# EAGLE schematic BPW5031 Arcade MegaWing (EAGLE 6.3)
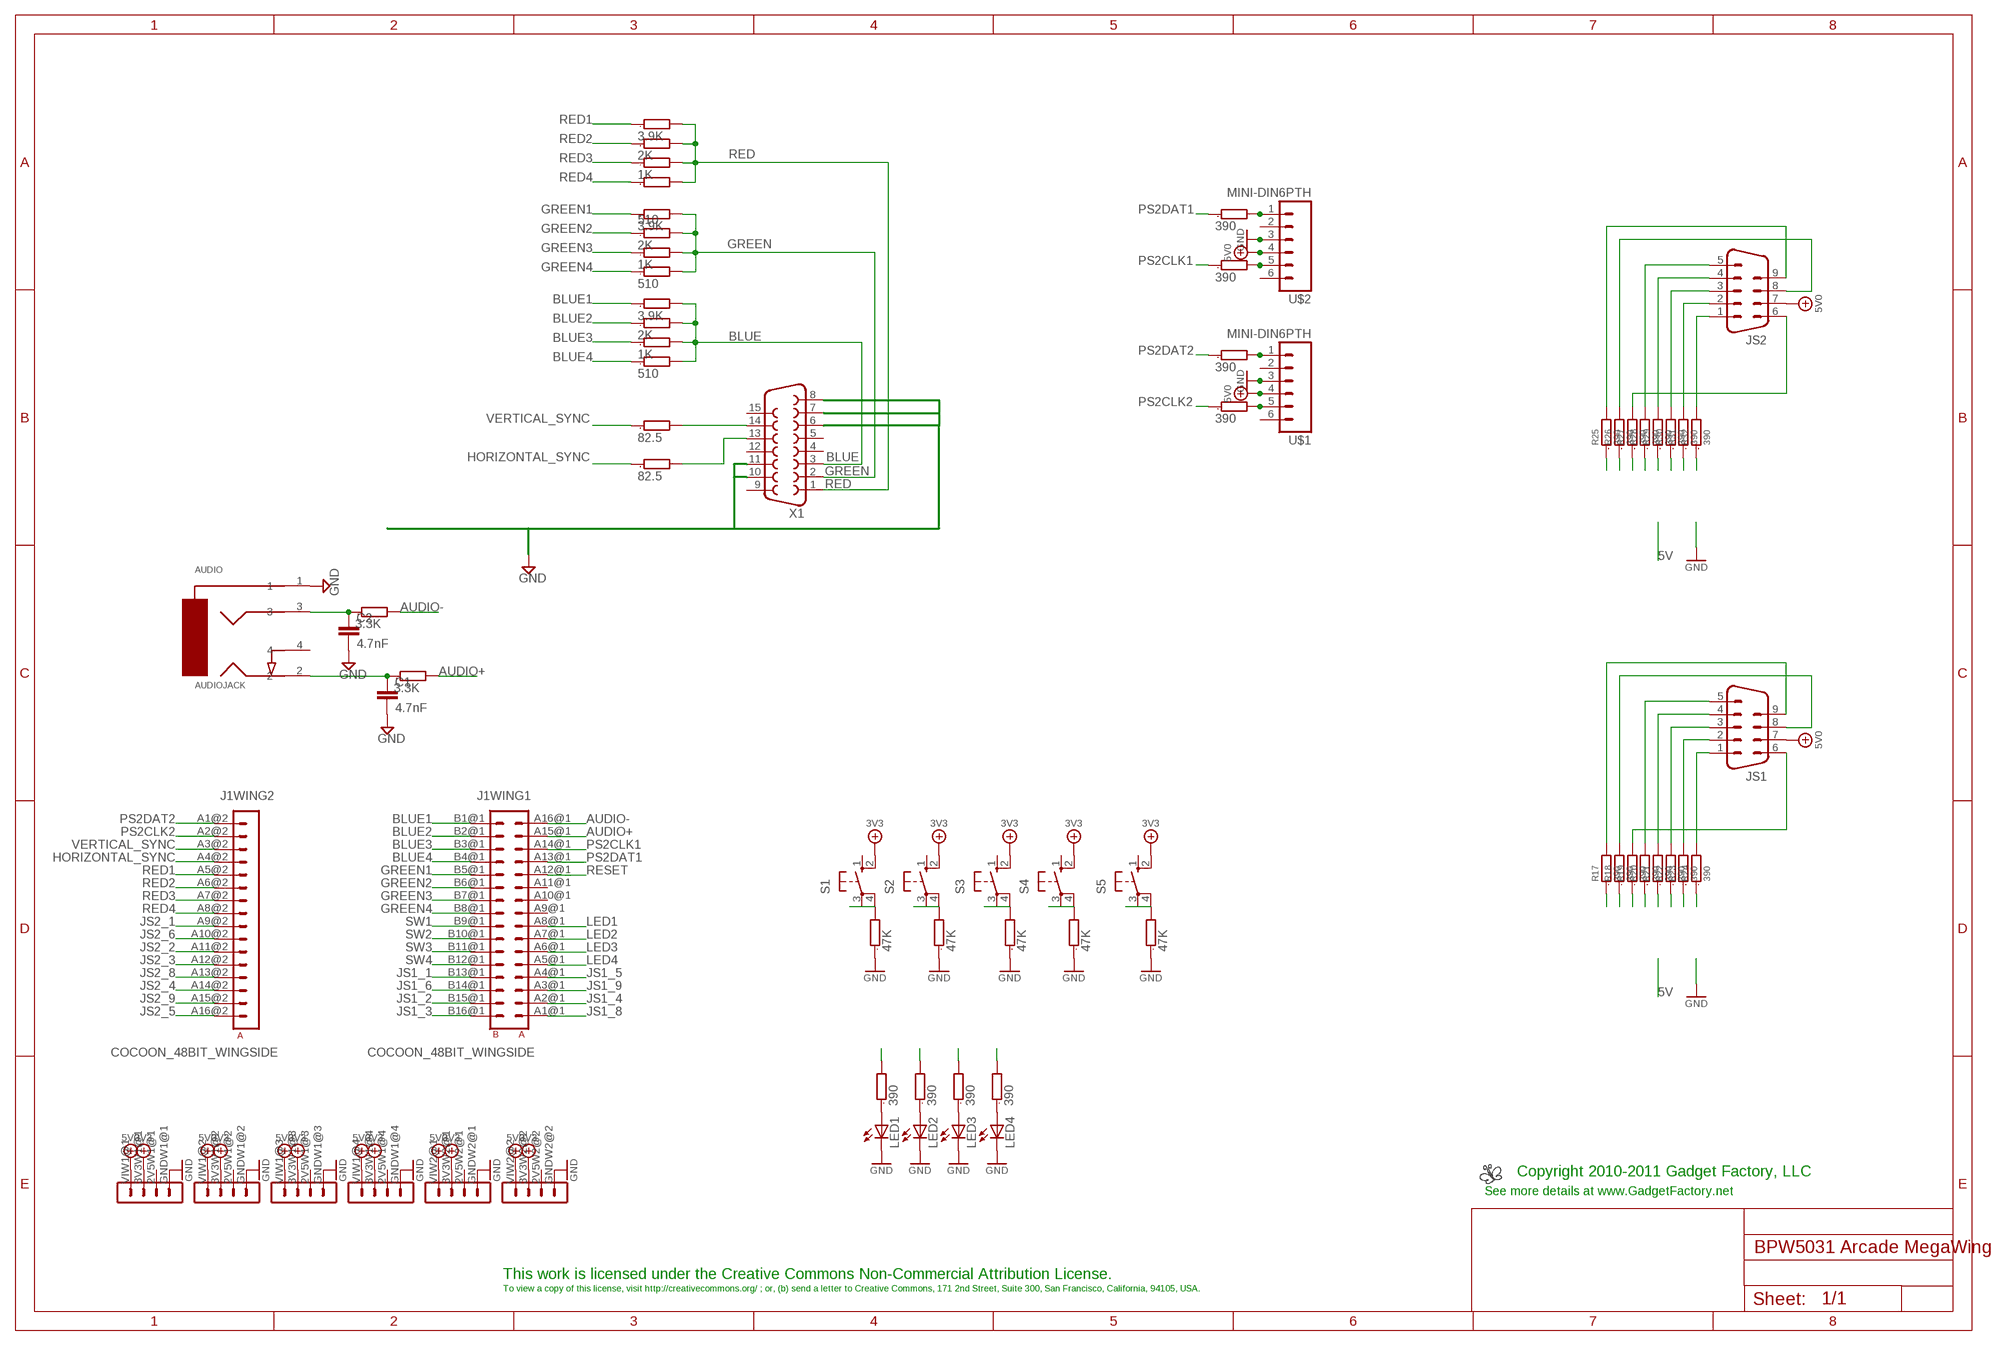
[diagram p0: schematic, sheet 1]

## Parts
AUDIO  AUDIOJACK  [AUDJCK]
C1  4.7nF  C-EU050-025X075  [C050-025X075]
C2  4.7nF  C-EU050-025X075  [C050-025X075]
J1  COCOON_48BIT_WINGSIDE  [COCOON_48BIT_WINGSIDE]
JS1  M09HP  [M09HP]
JS2  M09HP  [M09HP]
LED1  LEDCHIPLED_0603  [CHIPLED_0603]
LED2  LEDCHIPLED_0603  [CHIPLED_0603]
LED3  LEDCHIPLED_0603  [CHIPLED_0603]
LED4  LEDCHIPLED_0603  [CHIPLED_0603]
LOGO2  BUTTERFLY_LOGO  [BUTTERFLY_LOGO]
R1  3.9K  R0603  [0603]
R2  3.9K  R0603  [0603]
R3  3.9K  R0603  [0603]
R4  82.5  R0603  [0603]
R5  82.5  R0603  [0603]
R6  2K  R0603  [0603]
R7  2K  R0603  [0603]
R8  2K  R0603  [0603]
R9  1K  R0603  [0603]
R10  510  R0603  [0603]
R11  1K  R0603  [0603]
R12  510  R0603  [0603]
R13  1K  R0603  [0603]
R14  510  R0603  [0603]
R15  3.3K  R0603  [0603]
R16  3.3K  R0603  [0603]
R17  390  R0603  [0603]
R18  390  R0603  [0603]
R19  390  R0603  [0603]
R20  390  R0603  [0603]
R21  390  R0603  [0603]
R22  390  R0603  [0603]
R23  390  R0603  [0603]
R24  390  R0603  [0603]
R25  390  R0603  [0603]
R26  390  R0603  [0603]
R27  390  R0603  [0603]
R28  390  R0603  [0603]
R29  390  R0603  [0603]
R30  390  R0603  [0603]
R31  390  R0603  [0603]
R32  390  R0603  [0603]
R33  47K  R0603  [0603]
R34  47K  R0603  [0603]
R35  47K  R0603  [0603]
R36  47K  R0603  [0603]
R37  390  R0603  [0603]
R38  390  R0603  [0603]
R39  390  R0603  [0603]
R40  390  R0603  [0603]
R41  47K  R0603  [0603]
R42  390  R0603  [0603]
R43  390  R0603  [0603]
R44  390  R0603  [0603]
R45  390  R0603  [0603]
S1  10-XX  [B3F-10XX]
S2  10-XX  [B3F-10XX]
S3  10-XX  [B3F-10XX]
S4  10-XX  [B3F-10XX]
S5  10-XX  [B3F-10XX]
U$1  MINI-DIN6PTH  [MINI-DIN6]
U$2  MINI-DIN6PTH  [MINI-DIN6]
X1  F15HDH  [HDF15H]

## Nets
3V3: J1.3V3W1@1(3V3) J1.3V3W1@2(3V3) J1.3V3W1@3(3V3) J1.3V3W1@4(3V3) J1.3V3W2@1(3V3) J1.3V3W2@2(3V3) S1.2(S1) S2.2(S1) S3.2(S1) S4.2(S1) S5.2(S1)
5V0: J1.VIW1@1(5V) J1.VIW1@2(5V) J1.VIW1@3(5V) J1.VIW1@4(5V) J1.VIW2@1(5V) J1.VIW2@2(5V) JS1.7 JS2.7 U$1.4 U$2.4
AUDIO+: J1.A15@1(WING1:A15) R16.2
AUDIO-: J1.A16@1(WING1:A16) R15.2
BLUE: R3.2 R8.2 R13.2 R14.2 X1.3
BLUE1: J1.B1@1(WING1:B1) R3.1
BLUE2: J1.B2@1(WING1:B2) R8.1
BLUE3: J1.B3@1(WING1:B3) R13.1
BLUE4: J1.B4@1(WING1:B4) R14.1
GND: AUDIO.1 C1.2 C2.2 J1.GNDW1@1(GND) J1.GNDW1@2(GND) J1.GNDW1@3(GND) J1.GNDW1@4(GND) J1.GNDW2@1(GND) J1.GNDW2@2(GND) LED1.C LED2.C LED3.C LED4.C R33.1 R34.1 R35.1 R36.1 R41.1 U$1.3 U$2.3 X1.6 X1.7 X1.8 X1.10 X1.11
GREEN: R2.2 R7.2 R11.2 R12.2 X1.2
GREEN1: J1.B5@1(WING1:B5) R2.1
GREEN2: J1.B6@1(WING1:B6) R7.1
GREEN3: J1.B7@1(WING1:B7) R11.1
GREEN4: J1.B8@1(WING1:B8) R12.1
HORIZONTAL_SYNC: J1.A4@2(WING2:A4) R4.1
JS1_1: J1.B13@1(WING1:B13) R32.1
JS1_2: J1.B15@1(WING1:B15) R31.1
JS1_3: J1.B16@1(WING1:B16) R30.1
JS1_4: J1.A2@1(WING1:A2) R29.1
JS1_5: J1.A4@1(WING1:A4) R28.1
JS1_6: J1.B14@1(WING1:B14) R27.1
JS1_8: J1.A1@1(WING1:A1) R26.1
JS1_9: J1.A3@1(WING1:A3) R25.1
JS2_1: J1.A9@2(WING2:A9) R24.1
JS2_2: J1.A11@2(WING2:A11) R23.1
JS2_3: J1.A12@2(WING2:A12) R22.1
JS2_4: J1.A14@2(WING2:A14) R21.1
JS2_5: J1.A16@2(WING2:A16) R20.1
JS2_6: J1.A10@2(WING2:A10) R19.1
JS2_8: J1.A13@2(WING2:A13) R18.1
JS2_9: J1.A15@2(WING2:A15) R17.1
LED1: J1.A8@1(WING1:A8) R37.2
LED2: J1.A7@1(WING1:A7) R38.2
LED3: J1.A6@1(WING1:A6) R39.2
LED4: J1.A5@1(WING1:A5) R40.2
N$1: AUDIO.3 C2.1 R15.1
N$3: LED1.A R37.1
N$4: R4.2 X1.13
N$5: R5.2 X1.14
N$6: AUDIO.2 C1.1 R16.1
N$9: LED2.A R38.1
N$10: LED3.A R39.1
N$11: LED4.A R40.1
N$12: R42.2 U$2.1
N$13: R43.2 U$2.5
N$14: R44.2 U$1.1
N$15: R45.2 U$1.5
N$16: JS2.1 R32.2
N$17: JS2.2 R31.2
N$18: JS2.3 R30.2
N$19: JS2.4 R29.2
N$20: JS2.5 R28.2
N$21: JS2.9 R25.2
N$22: JS2.6 R27.2
N$23: JS2.8 R26.2
N$32: JS1.1 R24.2
N$33: JS1.2 R23.2
N$34: JS1.3 R22.2
N$35: JS1.4 R21.2
N$36: JS1.5 R20.2
N$37: JS1.9 R17.2
N$38: JS1.6 R19.2
N$39: JS1.8 R18.2
PS2CLK1: J1.A14@1(WING1:A14) R43.1
PS2CLK2: J1.A2@2(WING2:A2) R45.1
PS2DAT1: J1.A13@1(WING1:A13) R42.1
PS2DAT2: J1.A1@2(WING2:A1) R44.1
RED: R1.2 R6.2 R9.2 R10.2 X1.1
RED1: J1.A5@2(WING2:A5) R1.1
RED2: J1.A6@2(WING2:A6) R6.1
RED3: J1.A7@2(WING2:A7) R9.1
RED4: J1.A8@2(WING2:A8) R10.1
RESET: J1.A12@1(WING1:A12) R41.2 S5.3(P) S5.4(P1)
SW1: J1.B9@1(WING1:B9) R33.2 S1.3(P) S1.4(P1)
SW2: J1.B10@1(WING1:B10) R34.2 S2.3(P) S2.4(P1)
SW3: J1.B11@1(WING1:B11) R35.2 S3.3(P) S3.4(P1)
SW4: J1.B12@1(WING1:B12) R36.2 S4.3(P) S4.4(P1)
VERTICAL_SYNC: J1.A3@2(WING2:A3) R5.1
Unconnected: AUDIO.4 J1.2V5W1@1(2V5) J1.2V5W1@2(2V5) J1.2V5W1@3(2V5) J1.2V5W1@4(2V5) J1.2V5W2@1(2V5) J1.2V5W2@2(2V5) J1.A9@1(WING1:A9) J1.A10@1(WING1:A10) J1.A11@1(WING1:A11) S1.1(S) S2.1(S) S3.1(S) S4.1(S) S5.1(S) U$1.2 U$1.6 U$2.2 U$2.6 X1.4 X1.5 X1.9 X1.12 X1.15

## Notes on the sheet
- Copyright 2010-2011 Gadget Factory, LLC
- See more details at www.GadgetFactory.net
- This work is licensed under the Creative Commons Non-Commercial Attribution License.
- To view a copy of this license, visit http://creativecommons.org/ ; or, (b) send a letter to Creative Commons, 171 2nd Street, Suite 300, San Francisco, California, 94105, USA.

## Library data of the parts
AUDIO = GadgetFactory_6.0:AUDIOJACK
C1 C2 = resistor:C-EU: CAPACITOR, European symbol
J1 = usb1:COCOON_48BIT_WINGSIDE
JS1 JS2 = con-subd:M09: SUB-D; OC_FARNELL: unknown; OC_NEWARK: unknown
LED1-LED4 = led:LED: LED OSRAM: - CHIPLED LG R971, LG N971, LY N971, LG Q971, LY Q971, LO R971, LY R971 LH N974, LH R974 LS Q976, LO Q976, LY Q976 LO Q996 - Hyper CHIPLED LW Q18S LB Q993, LB Q99A, LB R99A - SideLED LS A670, LO A670, LY A670, LG A670, LP A670 LB A673, LV A673, LT A673, LW A673 LH A674 LY A675 LS A676, LA A676, LO A676, LY A676, LW A676 LS A679, LY A679, LG A679 - Hyper Micro SIDELED® LS Y876, LA Y876, LO Y876, LY Y876 LT Y87S - SmartLED LW L88C, LW L88S LB L89C, LB L89S, LG L890 LS L89K, LO L89K, LY L89K LS L896, LA L896, LO L896, LY L896 - TOPLED LS T670, LO T670, LY T670, LG T670, LP T670 LSG T670, LSP T670, LSY T670, LOP T670, LYG T670 LG T671, LOG T671, LSG T671 LB T673, LV T673, LT T673, LW T673 LH T674 LS T676, LA T676, LO T676, LY T676, LB T676, LH T676, LSB T676, LW T676 LB T67C, LV T67C, LT T67C, LS T67K, LO T67K, LY T67K, LW E67C LS E67B, LA E67B, LO E67B, LY E67B, LB E67C, LV E67C, LT E67C LW T67C LS T679, LY T679, LG T679 LS T770, LO T770, LY T770, LG T770, LP T770 LB T773, LV T773, LT T773, LW T773 LH T774 LS E675, LA E675, LY E675, LS T675 LS T776, LA T776, LO T776, LY T776, LB T776 LHGB T686 LT T68C, LB T68C - Hyper Mini TOPLED® LB M676 - Mini TOPLED Santana® LG M470 LS M47K, LO M47K, LY M47K Source: http://www.osram.convergy.de LUXEON: - LUMILED® LXK2-PW12-R00, LXK2-PW12-S00, LXK2-PW14-U00, LXK2-PW14-V00 LXK2-PM12-R00, LXK2-PM12-S00, LXK2-PM14-U00 LXK2-PE12-Q00, LXK2-PE12-R00, LXK2-PE12-S00, LXK2-PE14-T00, LXK2-PE14-U00 LXK2-PB12-K00, LXK2-PB12-L00, LXK2-PB12-M00, LXK2-PB14-N00, LXK2-PB14-P00, LXK2-PB14-Q00 LXK2-PR12-L00, LXK2-PR12-M00, LXK2-PR14-Q00, LXK2-PR14-R00 LXK2-PD12-Q00, LXK2-PD12-R00, LXK2-PD12-S00 LXK2-PH12-R00, LXK2-PH12-S00 LXK2-PL12-P00, LXK2-PL12-Q00, LXK2-PL12-R00 Source: www.luxeon.com KINGBRIGHT: KA-3528ASYC Source: www.kingbright.com
LOGO2 = GadgetFactory_Pub:BUTTERFLY_LOGO
R1-R45 = GadgetFactory:R: RESISTOR, European symbol
S1-S5 = opto:10-XX: OMRON SWITCH
U$1 U$2 = SparkFun-Connectors:MINI-DIN6: mini DIN 6 Connector Commonly found on the back of a computer for PS2 keyboard and mice. Schematic and footprint are proven. Spark Fun Electronics SKU : PRT-08509
X1 = GadgetFactory_6.0:F15: SUB-D; OC_FARNELL: unknown; OC_NEWARK: unknown